# Altium project STM32F103C8T6.PrjPcb
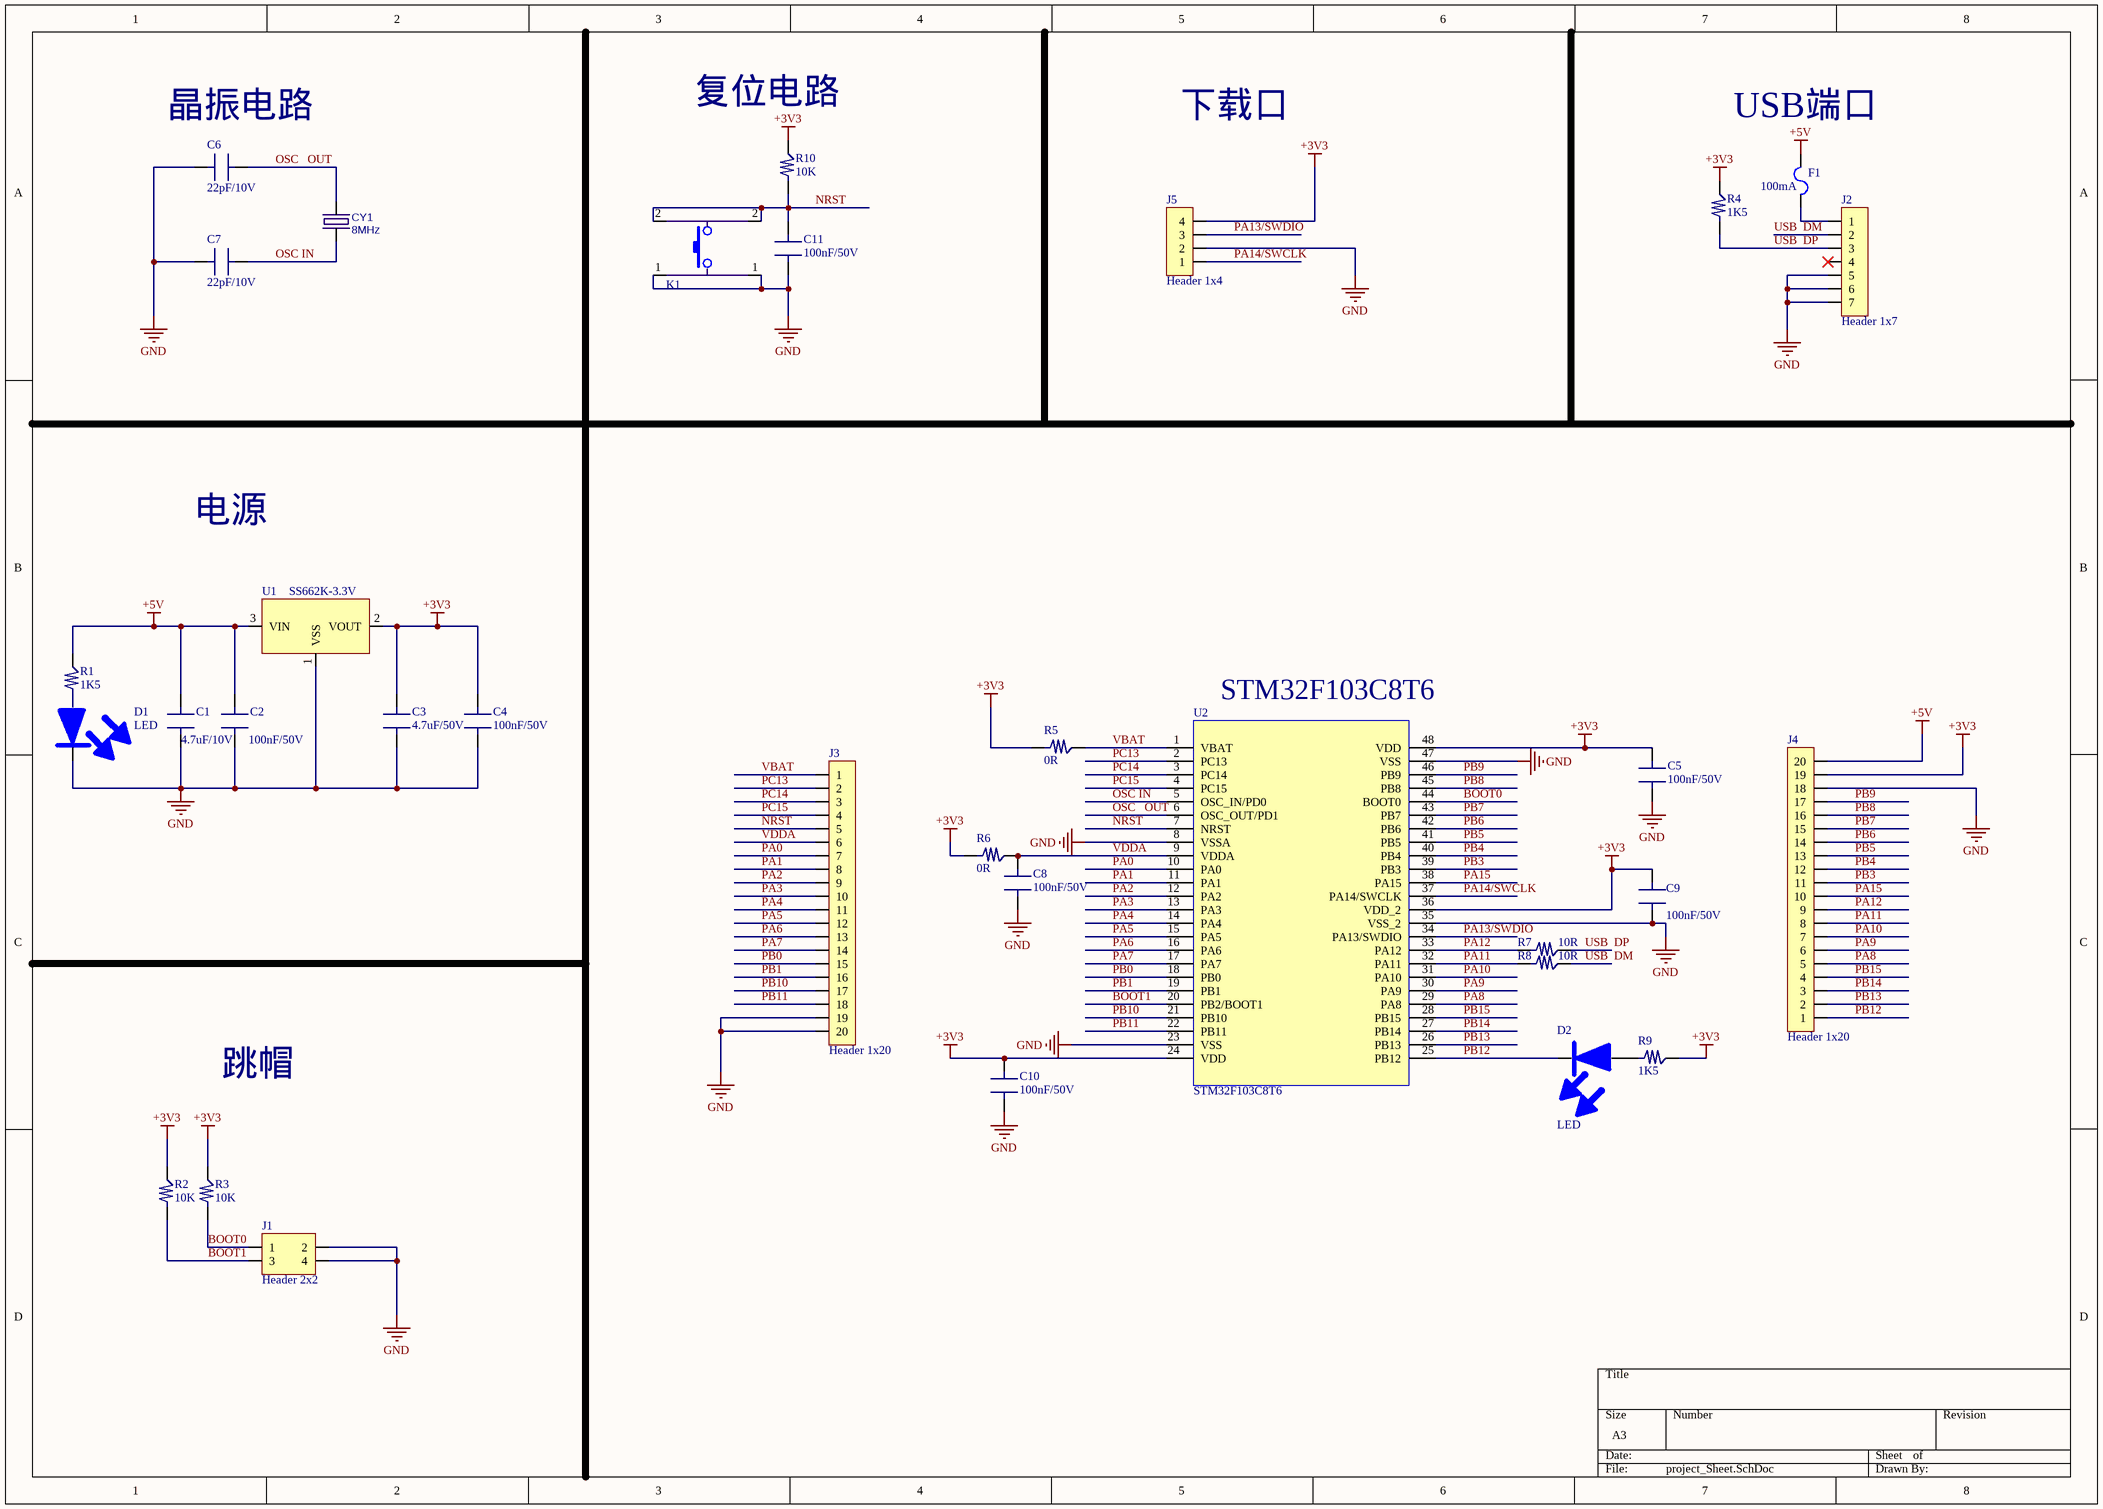
[diagram p0: project_Sheet.SchDoc]
1 sheet, 33 parts. Net scope: global (net labels, ports and power ports of the same name join across sheets).
Board file: projct_PCB.PcbDoc

## Sheet project_Sheet.SchDoc
size A3; SheetNumber: 1; SheetTotal: 1

### Parts
C1  4.7uF/10V  [0603CC]
C2  100nF/50V  [0603CC]
C3  4.7uF/50V  [0805CC]
C4  100nF/50V  [0805CC]
C5  100nF/50V  [0603CC]
C6  22pF/10V  [0603CC]
C7  22pF/10V  [0603CC]
C8  100nF/50V  [0603CC]
C9  100nF/50V  [0603CC]
C10  100nF/50V  [0603CC]
C11  100nF/50V  [0603CC]
CY1  8MHz  [HC-49S]
D1  LED  [0603LED]
D2  LED  [0603LED]
F1  100mA  [R0805]
J1  Header 2x2  [HDR2X2]
J2  Header 1x7  [PCBComponent_1]
J3  Header 1x20  [HDR1X20]
J4  Header 1x20  [HDR1X20]
J5  Header 1x4  [HDR1X4]
K1  SW4P  [4.5*4.5*3.8]  (value not drawn)
R1  1K5  [0603R]
R2  10K  [0603R]
R3  10K  [0603R]
R4  1K5  [0603R]
R5  0R  [0603R]
R6  0R  [0603R]
R7  10R  [0603R]
R8  10R  [0603R]
R9  1K5  [0603R]
R10  10K  [0603R]
U1  SS662K-3.3V  [SOT23-JX]
U2  STM32F103C8T6  [LQFP48]

### Nets
+3V3: C3.2 C4.2 C5.2 C9.2 C10.2 J4.19 J5.4 R2.2 R3.2 R4.2 R5.1 R6.1 R9.2 R10.2 U1.2(VOUT) U2.24(VDD) U2.36(VDD_2) U2.48(VDD)
+5V: C1.2 C2.2 F1.2 J4.20 R1.2 U1.3(VIN)
GND: C1.1 C2.1 C3.1 C4.1 C5.1 C6.1 C7.1 C8.1 C9.1 C10.1 C11.1 D1.2 J1.2 J1.4 J2.5 J2.6 J2.7 J3.19 J3.20 J4.18 J5.2 K1.1 U1.1(VSS) U2.8(VSSA) U2.23(VSS) U2.35(VSS_2) U2.47(VSS)
BOOT0: J1.1 R3.1 U2.44(BOOT0)
BOOT1: J1.3 R2.1 U2.20(PB2/BOOT1)
NRST: C11.2 J3.5 K1.2 R10.1 U2.7(NRST)
OSC   OUT: C6.2 CY1.2 U2.6(OSC_OUT/PD1)
OSC IN: C7.2 CY1.1 U2.5(OSC_IN/PD0)
PA0: J3.7 U2.10(PA0)
PA1: J3.8 U2.11(PA1)
PA2: J3.9 U2.12(PA2)
PA3: J3.10 U2.13(PA3)
PA4: J3.11 U2.14(PA4)
PA5: J3.12 U2.15(PA5)
PA6: J3.13 U2.16(PA6)
PA7: J3.14 U2.17(PA7)
PA8: J4.5 U2.29(PA8)
PA9: J4.6 U2.30(PA9)
PA10: J4.7 U2.31(PA10)
PA11: J4.8 R8.1 U2.32(PA11)
PA12: J4.9 R7.1 U2.33(PA12)
PA13/SWDIO: J5.3 U2.34(PA13/SWDIO)
PA14/SWCLK: J5.1 U2.37(PA14/SWCLK)
PA15: J4.10 U2.38(PA15)
PB0: J3.15 U2.18(PB0)
PB1: J3.16 U2.19(PB1)
PB3: J4.11 U2.39(PB3)
PB4: J4.12 U2.40(PB4)
PB5: J4.13 U2.41(PB5)
PB6: J4.14 U2.42(PB6)
PB7: J4.15 U2.43(PB7)
PB8: J4.16 U2.45(PB8)
PB9: J4.17 U2.46(PB9)
PB10: J3.17 U2.21(PB10)
PB11: J3.18 U2.22(PB11)
PB12: D2.2 J4.1 U2.25(PB12)
PB13: J4.2 U2.26(PB13)
PB14: J4.3 U2.27(PB14)
PB15: J4.4 U2.28(PB15)
PC13: J3.2 U2.2(PC13)
PC14: J3.3 U2.3(PC14)
PC15: J3.4 U2.4(PC15)
USB  DM: J2.2 R8.2
USB  DP: J2.3 R4.1 R7.2
VBAT: J3.1 R5.2 U2.1(VBAT)
VDDA: C8.2 J3.6 R6.2 U2.9(VDDA)
NetD1_1: D1.1 R1.1
NetD2_1: D2.1 R9.1
NetF1_1: F1.1 J2.1

Not connected (* = marked no-connect by the designer): J2 4*

### Notes on the sheet
- (near R10) 复位电路
- (near C6) 晶振电路
- 下载口
- (near F1) USB端口
- 电源
- (near U2) STM32F103C8T6
- 跳帽

### Library data of the parts
C1-C11 = CAP
CY1 = CY2P: 2pin晶振; catid: 20; spicePre: Y; BOM_Supplier: LCSC
F1 = FUSE: 保险丝
J1 = Header2*2: 双排连接器
J2 = Header 1x7: 单排连接器
J3 J4 = Header 1x20: 单排连接器
J5 = Header 1x4: 单排连接器
K1 = SW4P: 4Pin轻触按键
R1-R10 = RES: 分立电阻
U1 = SS662K
U2 = STM32F103C8T6: STM32单片机